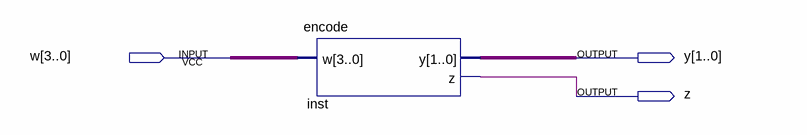
[diagram p0: schematic sheet]
// Quartus schematic encodeModified.bdf as structural Verilog: 1 symbols, 3 pins
module encodeModified (
  input  [3:0] w,
  output [1:0] y,
  output z
);

  encode inst (.w(w), .y(y), .z(z));
endmodule
